# Altium schematic sheet Line  Reader.SchDoc
size A
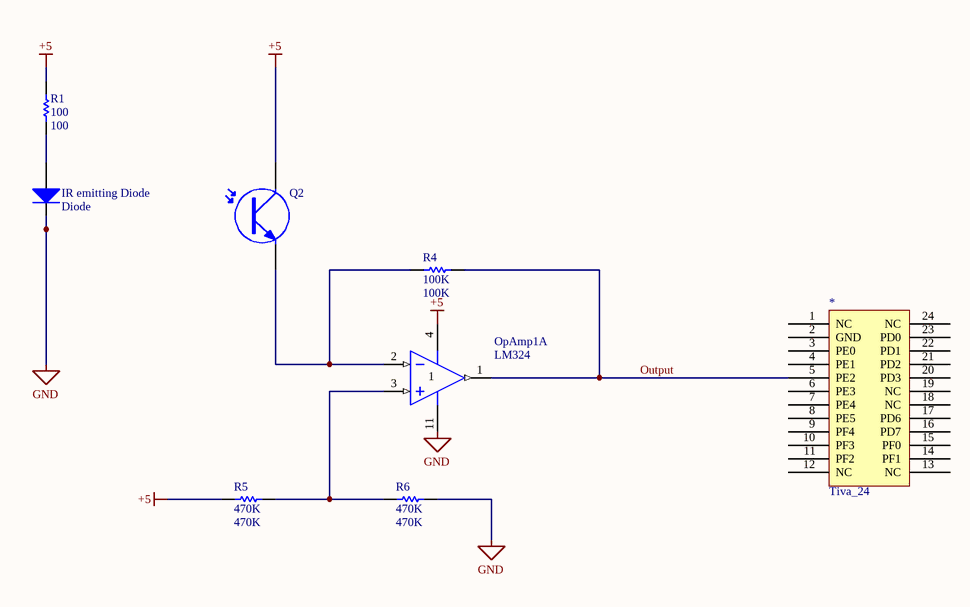
[diagram p0: Line  Reader.SchDoc]

## Parts
*  Tiva_24
IR_emitting_Diode  Diode  [DSO-C2/X3.3]
OpAmp1  LM324  [DIP-14]  (part A of 4)
Q2  LTR 3208  [SFM-T2(3)/X1.6V]  (value not drawn)
R1  100  [AXIAL-0.3]
R4  100K  [AXIAL-0.3]
R5  470K  [AXIAL-0.3]
R6  470K  [AXIAL-0.3]

## Nets
+5: OpAmp1.4(V+) Q2.1(C) R1.2 R5.1
GND: IR_emitting_Diode.2(K) OpAmp1.11(GND) R6.2
Output: *.5(PE2) OpAmp1.1(OUT) R4.2
NetIR_emitting_Diode_1: IR_emitting_Diode.1(A) R1.1
NetOpAmp1_2: OpAmp1.2(IN-) Q2.3(E) R4.1
NetOpAmp1_3: OpAmp1.3(IN+) R5.2 R6.1

Not connected (* = marked no-connect by the designer): * 1(NC) 2(GND) 3(PE0) 4(PE1) 6(PE3) 7(PE4) 8(PE5) 9(PF4) 10(PF3) 11(PF2) 12(NC) 13(NC) 14(PF1) 15(PF0) 16(PD7) 17(PD6) 18(NC) 19(NC) 20(PD3) 21(PD2) 22(PD1) 23(PD0) 24(NC)

## Library data of the parts
* = Tiva_24: Tiva Protection 24 Pin Connector
IR_emitting_Diode = Diode: Default Diode; Manufacturer: Generic Components; Class: Discrete; SubClass: Diode - Switching; Published: 08/06/2000; Publisher: Altium Hobart Technology Centre
OpAmp1 = LM324AJ: Low-Power Quad Operational Amplifier; Manufacturer: National Semiconductor; Published: 15/04/2002; Publisher: Altium Hobart Technology Centre; Class: Amplifier; SubClass: Operational Amplifier
Q2 = Photo NPN: NPN Phototransistor; Manufacturer: Generic Components; Class: Optoelectronic; Published: 1999; Name: LTR 3208
R1 R4-R6 = Res1: Resistor; Manufacturer: Generic Components; Class: Passive; Published: 08/06/2000; Publisher: Altium Hobart Technology Centre; SubClass: Resistor
  R1: Value: 100
  R4: Value: 100K
  R5 R6: Value: 470K